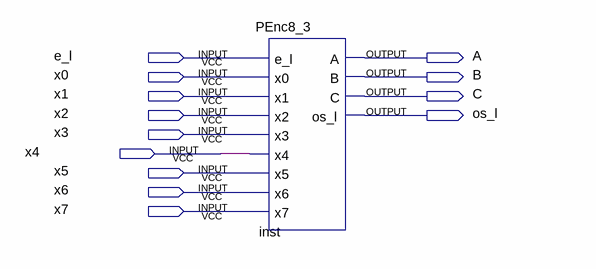
[diagram p0: schematic sheet]
// Quartus schematic EncoderDemo.bdf as structural Verilog: 1 symbols, 13 pins
module EncoderDemo (
  input  e_l,
  input  x0,
  input  x1,
  input  x2,
  input  x3,
  input  x4,
  input  x5,
  input  x6,
  input  x7,
  output A,
  output B,
  output C,
  output os_l
);

  PEnc8_3 inst (
    .e_l(e_l), .x0(x0), .x1(x1), .x2(x2), .x3(x3), .x4(x4), .x5(x5), .x6(x6), .x7(x7), .A(A), .B(B), .C(C),
    .os_l(os_l));
endmodule
